# Altium schematic sheet Clavier.SchDoc: Clavier KeyBored
size Letter; ApprovedBy: APPROUVÉ PAR; Author: Thomas Lajoie; Organization: Cegep Limoilou; Address1: 1300, 8e Avenue; Address2: Québec, QC; Address3: Canada; Address4: G1J 5L5; Revision: A; SheetNumber: 1; SheetTotal: 6
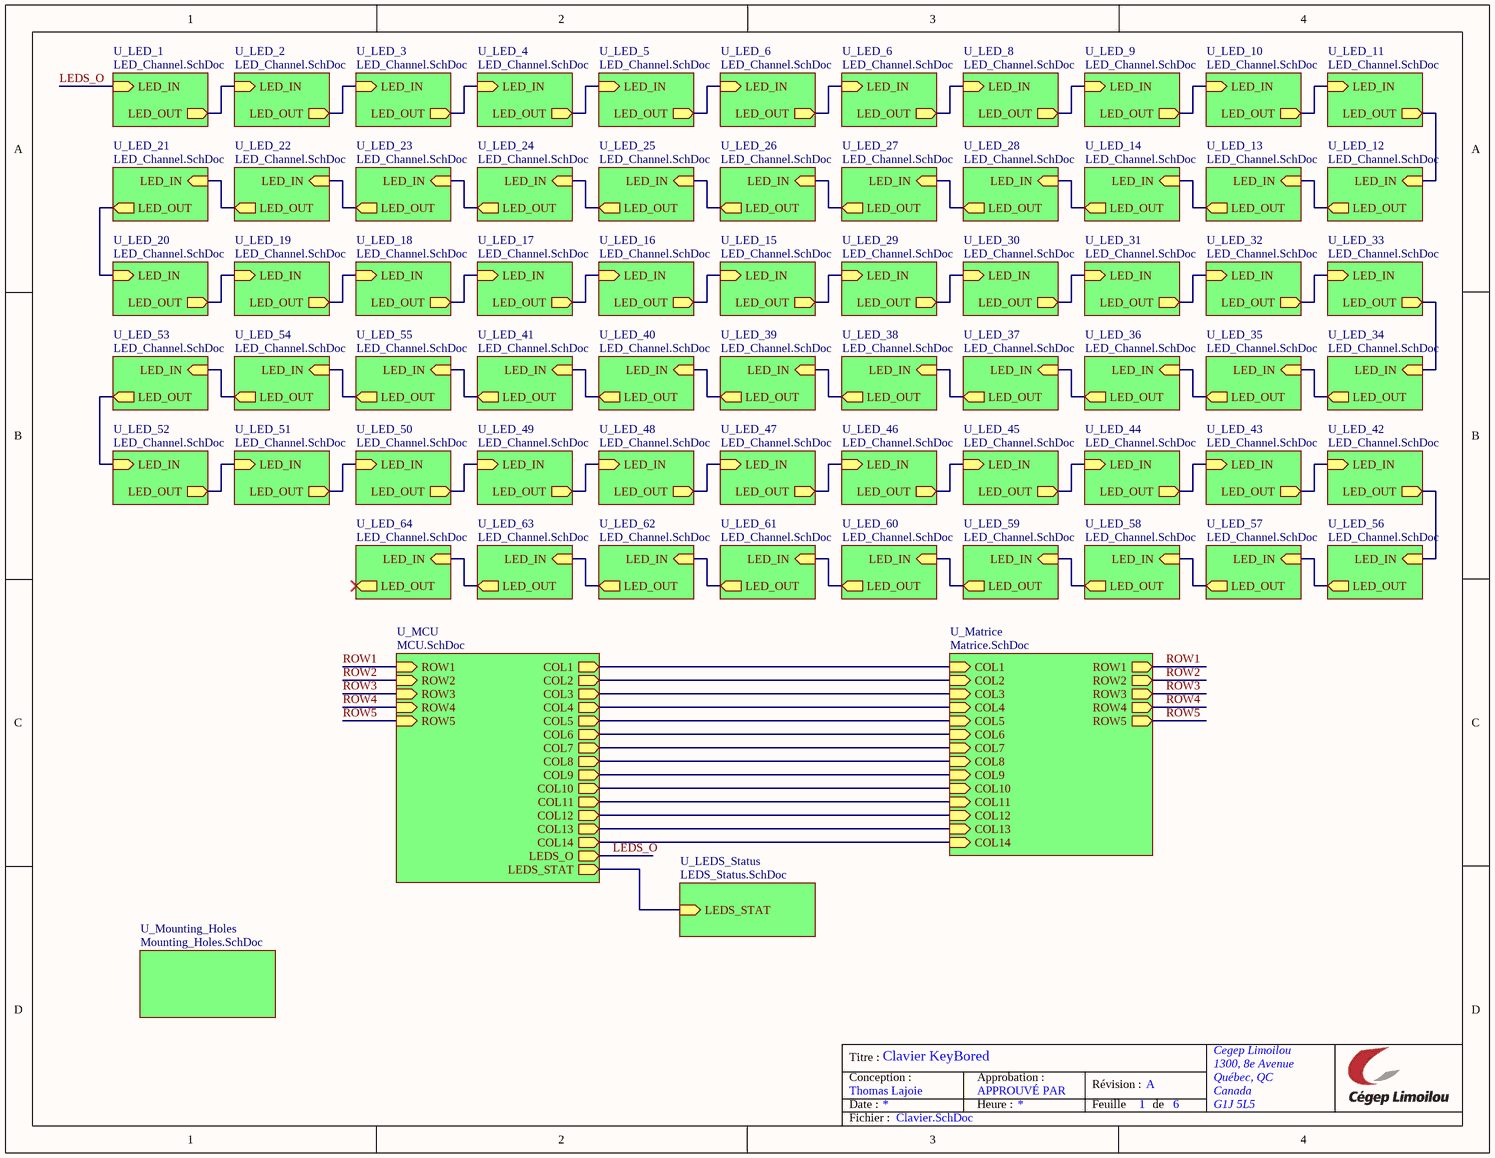
[diagram p0: Clavier.SchDoc]

## Sub-sheets
U_LED_1 = LED_Channel.SchDoc: LED_IN (in), LED_OUT (out)
U_LED_2 = LED_Channel.SchDoc: LED_IN (in), LED_OUT (out)
U_LED_3 = LED_Channel.SchDoc: LED_IN (in), LED_OUT (out)
U_LED_4 = LED_Channel.SchDoc: LED_IN (in), LED_OUT (out)
U_LED_5 = LED_Channel.SchDoc: LED_IN (in), LED_OUT (out)
U_LED_6 = LED_Channel.SchDoc: LED_IN (in), LED_OUT (out)
U_LED_6 = LED_Channel.SchDoc: LED_IN (in), LED_OUT (out)
U_LED_8 = LED_Channel.SchDoc: LED_IN (in), LED_OUT (out)
U_LED_9 = LED_Channel.SchDoc: LED_IN (in), LED_OUT (out)
U_LED_10 = LED_Channel.SchDoc: LED_IN (in), LED_OUT (out)
U_LED_11 = LED_Channel.SchDoc: LED_IN (in), LED_OUT (out)
U_LED_12 = LED_Channel.SchDoc: LED_IN (in), LED_OUT (out)
U_LED_13 = LED_Channel.SchDoc: LED_IN (in), LED_OUT (out)
U_LED_14 = LED_Channel.SchDoc: LED_IN (in), LED_OUT (out)
U_LED_15 = LED_Channel.SchDoc: LED_IN (in), LED_OUT (out)
U_LED_16 = LED_Channel.SchDoc: LED_IN (in), LED_OUT (out)
U_LED_17 = LED_Channel.SchDoc: LED_IN (in), LED_OUT (out)
U_LED_18 = LED_Channel.SchDoc: LED_IN (in), LED_OUT (out)
U_LED_19 = LED_Channel.SchDoc: LED_IN (in), LED_OUT (out)
U_LED_20 = LED_Channel.SchDoc: LED_IN (in), LED_OUT (out)
U_LED_21 = LED_Channel.SchDoc: LED_IN (in), LED_OUT (out)
U_LED_22 = LED_Channel.SchDoc: LED_IN (in), LED_OUT (out)
U_LED_23 = LED_Channel.SchDoc: LED_IN (in), LED_OUT (out)
U_LED_24 = LED_Channel.SchDoc: LED_IN (in), LED_OUT (out)
U_LED_25 = LED_Channel.SchDoc: LED_IN (in), LED_OUT (out)
U_LED_26 = LED_Channel.SchDoc: LED_IN (in), LED_OUT (out)
U_LED_27 = LED_Channel.SchDoc: LED_IN (in), LED_OUT (out)
U_LED_28 = LED_Channel.SchDoc: LED_IN (in), LED_OUT (out)
U_LED_29 = LED_Channel.SchDoc: LED_IN (in), LED_OUT (out)
U_LED_30 = LED_Channel.SchDoc: LED_IN (in), LED_OUT (out)
U_LED_31 = LED_Channel.SchDoc: LED_IN (in), LED_OUT (out)
U_LED_32 = LED_Channel.SchDoc: LED_IN (in), LED_OUT (out)
U_LED_33 = LED_Channel.SchDoc: LED_IN (in), LED_OUT (out)
U_LED_34 = LED_Channel.SchDoc: LED_IN (in), LED_OUT (out)
U_LED_35 = LED_Channel.SchDoc: LED_IN (in), LED_OUT (out)
U_LED_36 = LED_Channel.SchDoc: LED_IN (in), LED_OUT (out)
U_LED_37 = LED_Channel.SchDoc: LED_IN (in), LED_OUT (out)
U_LED_38 = LED_Channel.SchDoc: LED_IN (in), LED_OUT (out)
U_LED_39 = LED_Channel.SchDoc: LED_IN (in), LED_OUT (out)
U_LED_40 = LED_Channel.SchDoc: LED_IN (in), LED_OUT (out)
U_LED_41 = LED_Channel.SchDoc: LED_IN (in), LED_OUT (out)
U_LED_42 = LED_Channel.SchDoc: LED_IN (in), LED_OUT (out)
U_LED_43 = LED_Channel.SchDoc: LED_IN (in), LED_OUT (out)
U_LED_44 = LED_Channel.SchDoc: LED_IN (in), LED_OUT (out)
U_LED_45 = LED_Channel.SchDoc: LED_IN (in), LED_OUT (out)
U_LED_46 = LED_Channel.SchDoc: LED_IN (in), LED_OUT (out)
U_LED_47 = LED_Channel.SchDoc: LED_IN (in), LED_OUT (out)
U_LED_48 = LED_Channel.SchDoc: LED_IN (in), LED_OUT (out)
U_LED_49 = LED_Channel.SchDoc: LED_IN (in), LED_OUT (out)
U_LED_50 = LED_Channel.SchDoc: LED_IN (in), LED_OUT (out)
U_LED_51 = LED_Channel.SchDoc: LED_IN (in), LED_OUT (out)
U_LED_52 = LED_Channel.SchDoc: LED_IN (in), LED_OUT (out)
U_LED_53 = LED_Channel.SchDoc: LED_IN (in), LED_OUT (out)
U_LED_54 = LED_Channel.SchDoc: LED_IN (in), LED_OUT (out)
U_LED_55 = LED_Channel.SchDoc: LED_IN (in), LED_OUT (out)
U_LED_56 = LED_Channel.SchDoc: LED_IN (in), LED_OUT (out)
U_LED_57 = LED_Channel.SchDoc: LED_IN (in), LED_OUT (out)
U_LED_58 = LED_Channel.SchDoc: LED_IN (in), LED_OUT (out)
U_LED_59 = LED_Channel.SchDoc: LED_IN (in), LED_OUT (out)
U_LED_60 = LED_Channel.SchDoc: LED_IN (in), LED_OUT (out)
U_LED_61 = LED_Channel.SchDoc: LED_IN (in), LED_OUT (out)
U_LED_62 = LED_Channel.SchDoc: LED_IN (in), LED_OUT (out)
U_LED_63 = LED_Channel.SchDoc: LED_IN (in), LED_OUT (out)
U_LED_64 = LED_Channel.SchDoc: LED_IN (in), LED_OUT (out)
U_LEDS_Status = LEDS_Status.SchDoc: LEDS_STAT (in)
U_Matrice = Matrice.SchDoc: COL1 (in), COL2 (in), COL3 (in), COL4 (in), COL5 (in), COL6 (in), COL7 (in), COL8 (in), COL9 (in), COL10 (in), COL11 (in), COL12 (in), COL13 (in), COL14 (in), ROW1 (out), ROW2 (out), ROW3 (out), ROW4 (out), ROW5 (out)
U_MCU = MCU.SchDoc: ROW1 (in), ROW2 (in), ROW3 (in), ROW4 (in), ROW5 (in), COL1 (out), COL2 (out), COL3 (out), COL4 (out), COL5 (out), COL6 (out), COL7 (out), COL8 (out), COL9 (out), COL10 (out), COL11 (out), COL12 (out), COL13 (out), COL14 (out), LEDS_O (out), LEDS_STAT (out)
U_Mounting_Holes = Mounting_Holes.SchDoc: no entries

## Nets
LEDS_O: sheet U_LED_1/LED_IN, sheet U_MCU/LEDS_O
ROW1: sheet U_Matrice/ROW1, sheet U_MCU/ROW1
ROW2: sheet U_Matrice/ROW2, sheet U_MCU/ROW2
ROW3: sheet U_Matrice/ROW3, sheet U_MCU/ROW3
ROW4: sheet U_Matrice/ROW4, sheet U_MCU/ROW4
ROW5: sheet U_Matrice/ROW5, sheet U_MCU/ROW5
(unnamed): sheet U_LED_1/LED_OUT, sheet U_LED_2/LED_IN
(unnamed): sheet U_LED_2/LED_OUT, sheet U_LED_3/LED_IN
(unnamed): sheet U_LED_3/LED_OUT, sheet U_LED_4/LED_IN
(unnamed): sheet U_LED_4/LED_OUT, sheet U_LED_5/LED_IN
(unnamed): sheet U_LED_5/LED_OUT, sheet U_LED_6/LED_IN
(unnamed): sheet U_LED_6/LED_OUT, sheet U_LED_6/LED_IN
(unnamed): sheet U_LED_6/LED_OUT, sheet U_LED_8/LED_IN
(unnamed): sheet U_LED_8/LED_OUT, sheet U_LED_9/LED_IN
(unnamed): sheet U_LED_9/LED_OUT, sheet U_LED_10/LED_IN
(unnamed): sheet U_LED_10/LED_OUT, sheet U_LED_11/LED_IN
(unnamed): sheet U_LED_11/LED_OUT, sheet U_LED_12/LED_IN
(unnamed): sheet U_LED_12/LED_OUT, sheet U_LED_13/LED_IN
(unnamed): sheet U_LED_13/LED_OUT, sheet U_LED_14/LED_IN
(unnamed): sheet U_LED_14/LED_OUT, sheet U_LED_28/LED_IN
(unnamed): sheet U_LED_15/LED_IN, sheet U_LED_16/LED_OUT
(unnamed): sheet U_LED_15/LED_OUT, sheet U_LED_29/LED_IN
(unnamed): sheet U_LED_16/LED_IN, sheet U_LED_17/LED_OUT
(unnamed): sheet U_LED_17/LED_IN, sheet U_LED_18/LED_OUT
(unnamed): sheet U_LED_18/LED_IN, sheet U_LED_19/LED_OUT
(unnamed): sheet U_LED_19/LED_IN, sheet U_LED_20/LED_OUT
(unnamed): sheet U_LED_20/LED_IN, sheet U_LED_21/LED_OUT
(unnamed): sheet U_LED_21/LED_IN, sheet U_LED_22/LED_OUT
(unnamed): sheet U_LED_22/LED_IN, sheet U_LED_23/LED_OUT
(unnamed): sheet U_LED_23/LED_IN, sheet U_LED_24/LED_OUT
(unnamed): sheet U_LED_24/LED_IN, sheet U_LED_25/LED_OUT
(unnamed): sheet U_LED_25/LED_IN, sheet U_LED_26/LED_OUT
(unnamed): sheet U_LED_26/LED_IN, sheet U_LED_27/LED_OUT
(unnamed): sheet U_LED_27/LED_IN, sheet U_LED_28/LED_OUT
(unnamed): sheet U_LED_29/LED_OUT, sheet U_LED_30/LED_IN
(unnamed): sheet U_LED_30/LED_OUT, sheet U_LED_31/LED_IN
(unnamed): sheet U_LED_31/LED_OUT, sheet U_LED_32/LED_IN
(unnamed): sheet U_LED_32/LED_OUT, sheet U_LED_33/LED_IN
(unnamed): sheet U_LED_33/LED_OUT, sheet U_LED_34/LED_IN
(unnamed): sheet U_LED_34/LED_OUT, sheet U_LED_35/LED_IN
(unnamed): sheet U_LED_35/LED_OUT, sheet U_LED_36/LED_IN
(unnamed): sheet U_LED_36/LED_OUT, sheet U_LED_37/LED_IN
(unnamed): sheet U_LED_37/LED_OUT, sheet U_LED_38/LED_IN
(unnamed): sheet U_LED_38/LED_OUT, sheet U_LED_39/LED_IN
(unnamed): sheet U_LED_39/LED_OUT, sheet U_LED_40/LED_IN
(unnamed): sheet U_LED_40/LED_OUT, sheet U_LED_41/LED_IN
(unnamed): sheet U_LED_41/LED_OUT, sheet U_LED_55/LED_IN
(unnamed): sheet U_LED_42/LED_IN, sheet U_LED_43/LED_OUT
(unnamed): sheet U_LED_42/LED_OUT, sheet U_LED_56/LED_IN
(unnamed): sheet U_LED_43/LED_IN, sheet U_LED_44/LED_OUT
(unnamed): sheet U_LED_44/LED_IN, sheet U_LED_45/LED_OUT
(unnamed): sheet U_LED_45/LED_IN, sheet U_LED_46/LED_OUT
(unnamed): sheet U_LED_46/LED_IN, sheet U_LED_47/LED_OUT
(unnamed): sheet U_LED_47/LED_IN, sheet U_LED_48/LED_OUT
(unnamed): sheet U_LED_48/LED_IN, sheet U_LED_49/LED_OUT
(unnamed): sheet U_LED_49/LED_IN, sheet U_LED_50/LED_OUT
(unnamed): sheet U_LED_50/LED_IN, sheet U_LED_51/LED_OUT
(unnamed): sheet U_LED_51/LED_IN, sheet U_LED_52/LED_OUT
(unnamed): sheet U_LED_52/LED_IN, sheet U_LED_53/LED_OUT
(unnamed): sheet U_LED_53/LED_IN, sheet U_LED_54/LED_OUT
(unnamed): sheet U_LED_54/LED_IN, sheet U_LED_55/LED_OUT
(unnamed): sheet U_LED_56/LED_OUT, sheet U_LED_57/LED_IN
(unnamed): sheet U_LED_57/LED_OUT, sheet U_LED_58/LED_IN
(unnamed): sheet U_LED_58/LED_OUT, sheet U_LED_59/LED_IN
(unnamed): sheet U_LED_59/LED_OUT, sheet U_LED_60/LED_IN
(unnamed): sheet U_LED_60/LED_OUT, sheet U_LED_61/LED_IN
(unnamed): sheet U_LED_61/LED_OUT, sheet U_LED_62/LED_IN
(unnamed): sheet U_LED_62/LED_OUT, sheet U_LED_63/LED_IN
(unnamed): sheet U_LED_63/LED_OUT, sheet U_LED_64/LED_IN
(unnamed): sheet U_Matrice/COL1, sheet U_MCU/COL1
(unnamed): sheet U_Matrice/COL2, sheet U_MCU/COL2
(unnamed): sheet U_Matrice/COL3, sheet U_MCU/COL3
(unnamed): sheet U_Matrice/COL4, sheet U_MCU/COL4
(unnamed): sheet U_Matrice/COL5, sheet U_MCU/COL5
(unnamed): sheet U_Matrice/COL6, sheet U_MCU/COL6
(unnamed): sheet U_Matrice/COL7, sheet U_MCU/COL7
(unnamed): sheet U_Matrice/COL8, sheet U_MCU/COL8
(unnamed): sheet U_Matrice/COL9, sheet U_MCU/COL9
(unnamed): sheet U_Matrice/COL10, sheet U_MCU/COL10
(unnamed): sheet U_Matrice/COL11, sheet U_MCU/COL11
(unnamed): sheet U_Matrice/COL12, sheet U_MCU/COL12
(unnamed): sheet U_Matrice/COL13, sheet U_MCU/COL13
(unnamed): sheet U_Matrice/COL14, sheet U_MCU/COL14
(unnamed): sheet U_MCU/LEDS_STAT, sheet U_LEDS_Status/LEDS_STAT

## Notes on the sheet
- Titre :
- Conception :
- Date :
- Approbation :
- Heure :
- Révision :
- Feuille
- de
- Fichier :